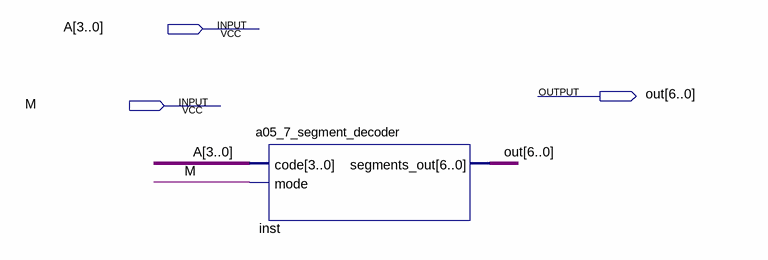
[diagram p0: schematic sheet]
// Quartus schematic a05_lab27SEGMENT.bdf as structural Verilog: 1 symbols, 3 pins
module a05_lab27SEGMENT (
  input  [3:0] A,
  input  M,
  output [6:0] out
);

  a05_7_segment_decoder inst (.code(A), .mode(M), .segments_out(out));
endmodule
